# EAGLE design motor-pid-v1 (EAGLE 5.12)
DATABASE: ../../partsdb.txt; PARTNO: MC000048
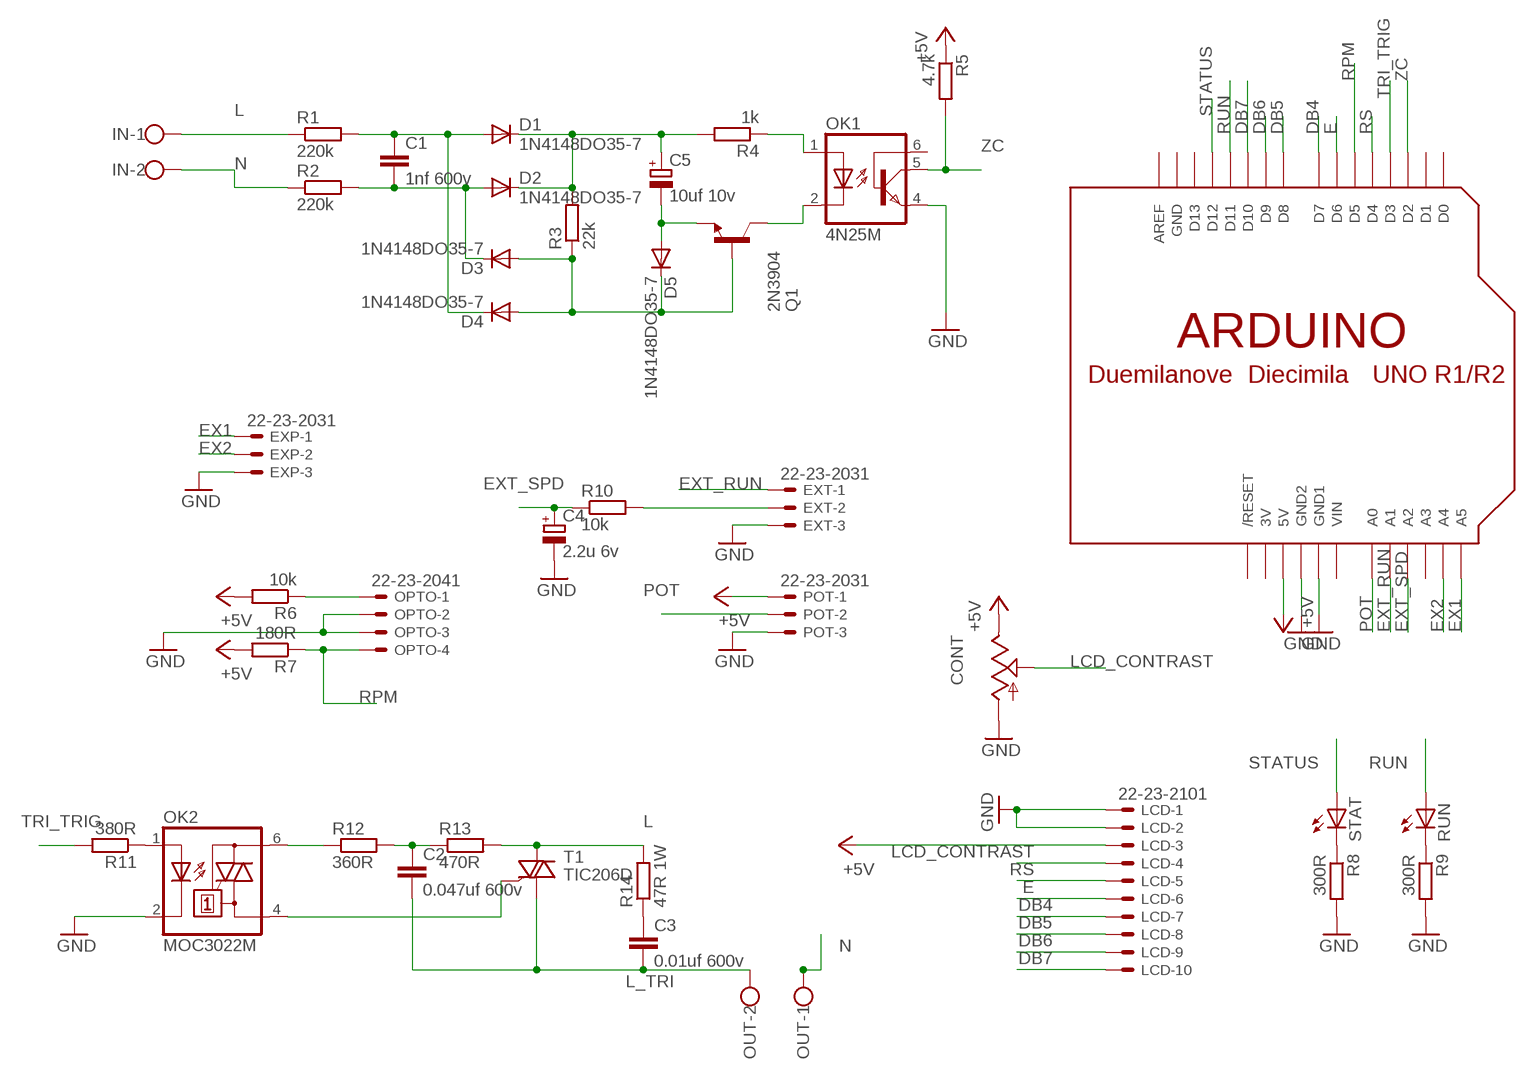
[diagram p0: schematic, sheet 1]

## Parts
C1  1nf 600v  C-EU075-052X106  [C075-052X106]
C2  0.047uf 600v  C-EU075-052X106  [C075-052X106]
C3  0.01uf 600v  C-EU050-050X075  [C050-050X075]
C4  2.2u 6v  CPOL-EUE1.8-4  [E1,8-4]
C5  10uf 10v  CPOL-EUE2.5-5  [E2,5-5]
CONT  TRIM  [6MM]
D1  1N4148DO35-7  DIODE-D-7.5  [D-7.5]
D2  1N4148DO35-7  DIODE-D-7.5  [D-7.5]
D3  1N4148DO35-7  DIODE-D-7.5  [D-7.5]
D4  1N4148DO35-7  DIODE-D-7.5  [D-7.5]
D5  1N4148DO35-7  DIODE-D-7.5  [D-7.5]
EXP  22-23-2031  [22-23-2031]
EXT  22-23-2031  [22-23-2031]
IN  W237-102  [W237-102]
LCD  22-23-2101  [22-23-2101]
OK1  4N25M  [DIL06]
OK2  MOC3022M  [DIL06]
OPTO  22-23-2041  [22-23-2041]
OUT  W237-102  [W237-102]
POT  22-23-2031  [22-23-2031]
Q1  2N3904  [TO92]
R1  220k  R-EU_0204/5  [0204/5]
R2  220k  R-EU_0204/5  [0204/5]
R3  22k  R-EU_0204/5  [0204/5]
R4  1k  R-EU_0204/5  [0204/5]
R5  4.7k  R-EU_0204/5  [0204/5]
R6  10k  R-EU_0204/5  [0204/5]
R7  180R  R-EU_0204/5  [0204/5]
R8  300R  R-EU_0204/5  [0204/5]
R9  300R  R-EU_0204/5  [0204/5]
R10  10k  R-EU_0204/5  [0204/5]
R11  380R  R-EU_0204/5  [0204/5]
R12  360R  R-EU_0207/7  [0207/7]
R13  470R  R-EU_0207/7  [0207/7]
R14  47R 1W  R-EU_0411/12  [0411/12]
RUN  LED5MM  [LED5MM]
STAT  LED5MM  [LED5MM]
T1  TIC206D  [TO220BV]
U$1  ARDUINO-NODIM  [ARDUINO-NODIM]

## Nets
2NB: D3.A D4.A D5.C Q1.2(B) R3.1
2NC: OK1.2(C) Q1.1(C)
2NE: C5.- D5.A Q1.3(E)
+5V: CONT.E LCD.3 POT.1 R5.1 R6.2 R7.2 U$1.5V
DB4: LCD.7 U$1.D7
DB5: LCD.8 U$1.D8
DB6: LCD.9 U$1.D9
DB7: LCD.10 U$1.D10
E: LCD.6 U$1.D6
EX1: EXP.1 U$1.A5
EX2: EXP.2 U$1.A4
EXT_RUN: EXT.1 U$1.A1
EXT_SPD: C4.+ R10.1 U$1.A2
GND: C4.- CONT.A EXP.3 EXT.3 LCD.1 LCD.2 OK1.4(EMI) OK2.2(C) OPTO.2 OPTO.3 POT.3 R8.2 R9.2 U$1.GND1 U$1.GND2
L [power]: IN.1 R1.1 R13.2 R14.2 T1.T2(A2)
L_TRI [power]: C2.2 C3.2 OUT.2 T1.T1(A1)
LCD_CONTRAST: CONT.S LCD.4
N [power]: IN.2 OUT.1 R2.1
N$1: OPTO.1 R6.1
N$2: OK2.6(A2) R12.1
N$3: C1.1 D1.A D4.C R1.2
N$4: C1.2 D2.A D3.C R2.2
N$5: C5.+ D1.C D2.C R3.2 R4.2
N$8: C2.1 R12.2 R13.1
N$9: OK1.1(A) R4.1
N$11: OK2.1(A) R11.1
N$12 [power]: C3.1 R14.1
N$13: R8.1 STAT.K(C)
N$14: R9.1 RUN.K(C)
N$16: EXT.2 R10.2
POT: POT.2 U$1.A0
RPM: OPTO.4 R7.1 U$1.D5
RS: LCD.5 U$1.D4
RUN: RUN.A U$1.D11
STATUS: STAT.A U$1.D12
TRI_GATE: OK2.4(A1) T1.G
TRI_TRIG: R11.2 U$1.D3
ZC: OK1.5(COL) R5.2 U$1.D2
Unconnected: OK1.6(BAS) U$1.A3 U$1.AREF U$1.D0 U$1.D1 U$1.D13 U$1.RESET(/RESET)

## Power pins joined to a net without a drawn wire
3V: U$1.3V
GND: U$1.GND
VIN: U$1.VIN

## Library data of the parts
C1-C3 = matt rcl:C-EU: CAPACITOR, European symbol
C4 = rcl:CPOL-EU: POLARIZED CAPACITOR, European symbol
C5 = matt rcl:CPOL-EU: POLARIZED CAPACITOR, European symbol
CONT = adafruit:TRIM
D1-D5 = diode:DIODE-: DIODE
EXP EXT POT = con-molex:22-23-2031: .100" (2.54mm) Center Header - 3 Pin; MF: MOLEX; MPN: 22-23-2031; OC_FARNELL: 1462950; OC_NEWARK: 30C0862
IN OUT = con-wago-500:W237-102: WAGO SCREW CLAMP; MPN: 237-102; OC_FARNELL: unknown; OC_NEWARK: 70K9898
LCD = con-molex:22-23-2101: .100" (2.54mm) Center Header - 10 Pin; MF: MOLEX; MPN: 22-23-2101; OC_FARNELL: 1756828; OC_NEWARK: 94C0765
OK1 = optocoupler:4N*?M: General Purpose 6-Pin Phototransistor Optocouplers Source: http://www.fairchildsemi.com/ds/4N/4N35-M.pdf; MPN: 4N25-M; OC_FARNELL: 1021349; OC_NEWARK: 98K9084
OK2 = optocoupler:MOC30*M: RANDOM-PHASE OPTOISOLATORS TRIAC DRIVER OUTPUT Source: http://www.fairchildsemi.com MOC3020-M.pdf; MF: FAIRCHILD SEMICONDUCTOR; MPN: MOC3022-M; OC_FARNELL: 1021086; OC_NEWARK: 58K1956
OPTO = con-molex:22-23-2041: .100" (2.54mm) Center Header - 4 Pin; MF: MOLEX; MPN: 22-23-2041; OC_FARNELL: 1462920; OC_NEWARK: 38C0355
Q1 = matt transistor-npn:2N3904: NPN Transistor
R1-R14 = matt rcl:R-EU_: RESISTOR, European symbol
RUN STAT = matt led:LED: LED OSRAM: - CHIPLED LG R971, LG N971, LY N971, LG Q971, LY Q971, LO R971, LY R971 LH N974, LH R974 LS Q976, LO Q976, LY Q976 LO Q996 - Hyper CHIPLED LW Q18S LB Q993, LB Q99A, LB R99A - SideLED LS A670, LO A670, LY A670, LG A670, LP A670 LB A673, LV A673, LT A673, LW A673 LH A674 LY A675 LS A676, LA A676, LO A676, LY A676, LW A676 LS A679, LY A679, LG A679 - Hyper Micro SIDELED® LS Y876, LA Y876, LO Y876, LY Y876 LT Y87S - SmartLED LW L88C, LW L88S LB L89C, LB L89S, LG L890 LS L89K, LO L89K, LY L89K LS L896, LA L896, LO L896, LY L896 - TOPLED LS T670, LO T670, LY T670, LG T670, LP T670 LSG T670, LSP T670, LSY T670, LOP T670, LYG T670 LG T671, LOG T671, LSG T671 LB T673, LV T673, LT T673, LW T673 LH T674 LS T676, LA T676, LO T676, LY T676, LB T676, LH T676, LSB T676, LW T676 LB T67C, LV T67C, LT T67C, LS T67K, LO T67K, LY T67K, LW E67C LS E67B, LA E67B, LO E67B, LY E67B, LB E67C, LV E67C, LT E67C LW T67C LS T679, LY T679, LG T679 LS T770, LO T770, LY T770, LG T770, LP T770 LB T773, LV T773, LT T773, LW T773 LH T774 LS E675, LA E675, LY E675, LS T675 LS T776, LA T776, LO T776, LY T776, LB T776 LHGB T686 LT T68C, LB T68C - Hyper Mini TOPLED® LB M676 - Mini TOPLED Santana® LG M470 LS M47K, LO M47K, LY M47K Source: http://www.osram.convergy.de LUXEON: - LUMILED® LXK2-PW12-R00, LXK2-PW12-S00, LXK2-PW14-U00, LXK2-PW14-V00 LXK2-PM12-R00, LXK2-PM12-S00, LXK2-PM14-U00 LXK2-PE12-Q00, LXK2-PE12-R00, LXK2-PE12-S00, LXK2-PE14-T00, LXK2-PE14-U00 LXK2-PB12-K00, LXK2-PB12-L00, LXK2-PB12-M00, LXK2-PB14-N00, LXK2-PB14-P00, LXK2-PB14-Q00 LXK2-PR12-L00, LXK2-PR12-M00, LXK2-PR14-Q00, LXK2-PR14-R00 LXK2-PD12-Q00, LXK2-PD12-R00, LXK2-PD12-S00 LXK2-PH12-R00, LXK2-PH12-S00 LXK2-PL12-P00, LXK2-PL12-Q00, LXK2-PL12-R00 Source: www.luxeon.com KINGBRIGHT: KA-3528ASYC Source: www.kingbright.com
T1 = triac:TIC206: TRIAC Source: http://www.bourns.com/pdfs/tic206.pdf
U$1 = adafruit:ARDUINO: Arduino Diecimila/Duemilanove Make a shield with ease, this package has all the named pins as well as the two mounting drill holes and an outline of the USB and DC power connector. The outline is on the DIMENSION layer, so if your board house uses it they will cut the outline to match. http://www.ladyada.net/library/pcb/eaglelibrary.html

## Net classes
1 power: width 1.524 mm, clearance 1.016 mm

## Board
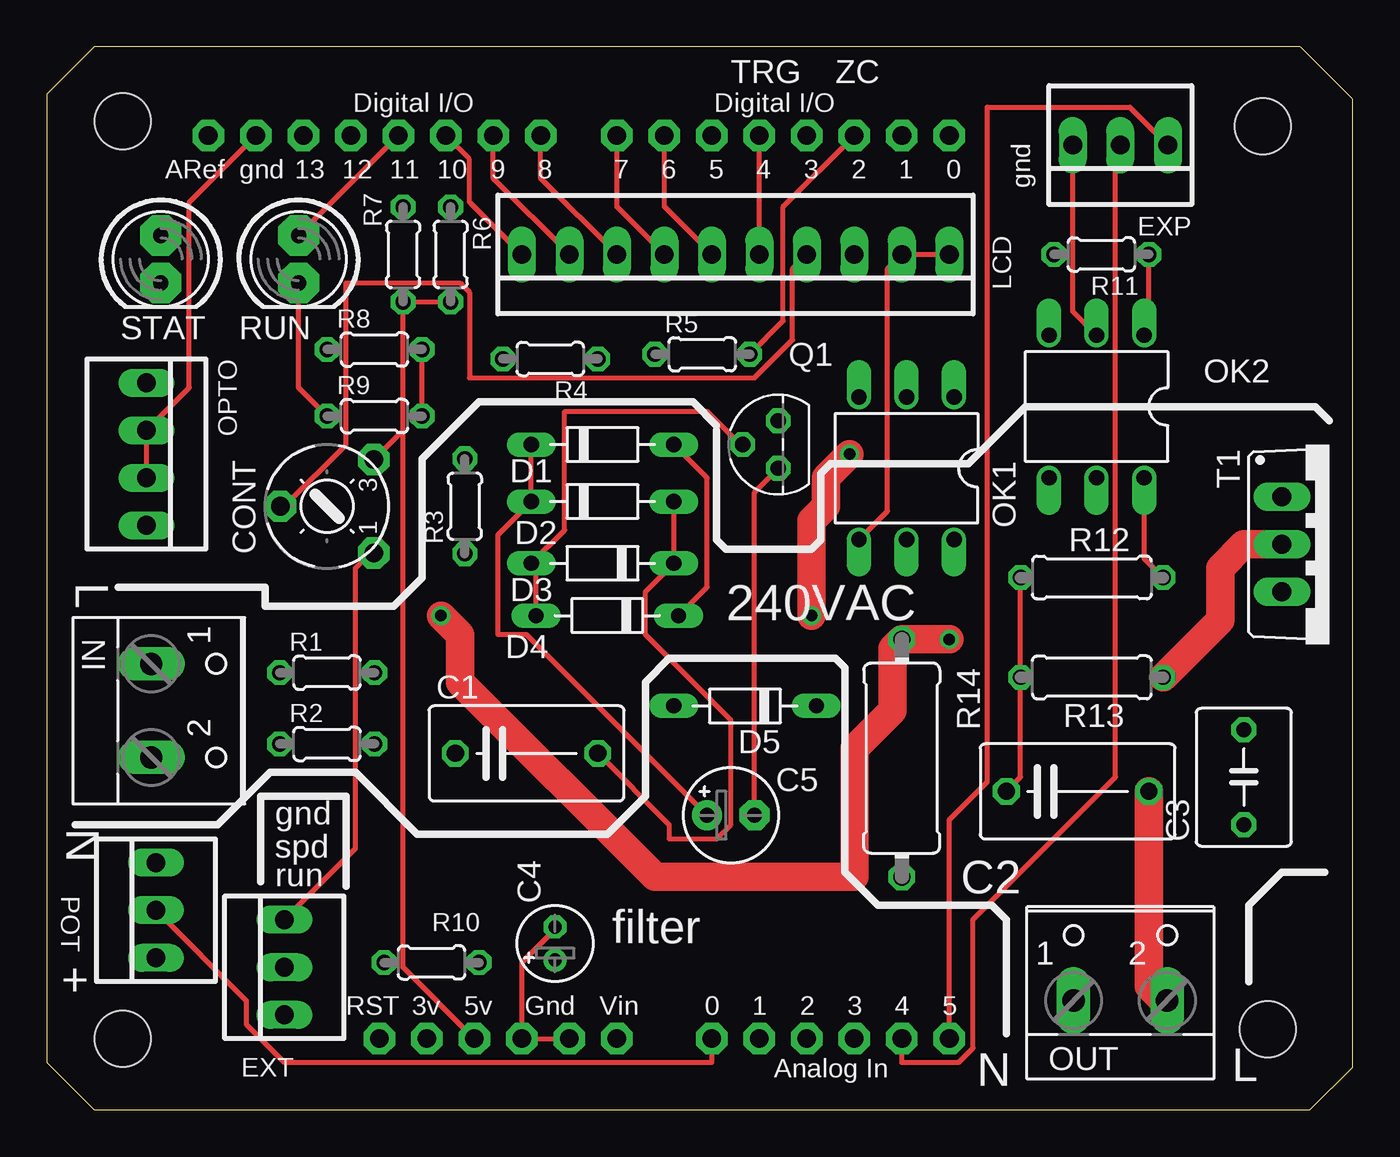
[diagram p1: board, top side]
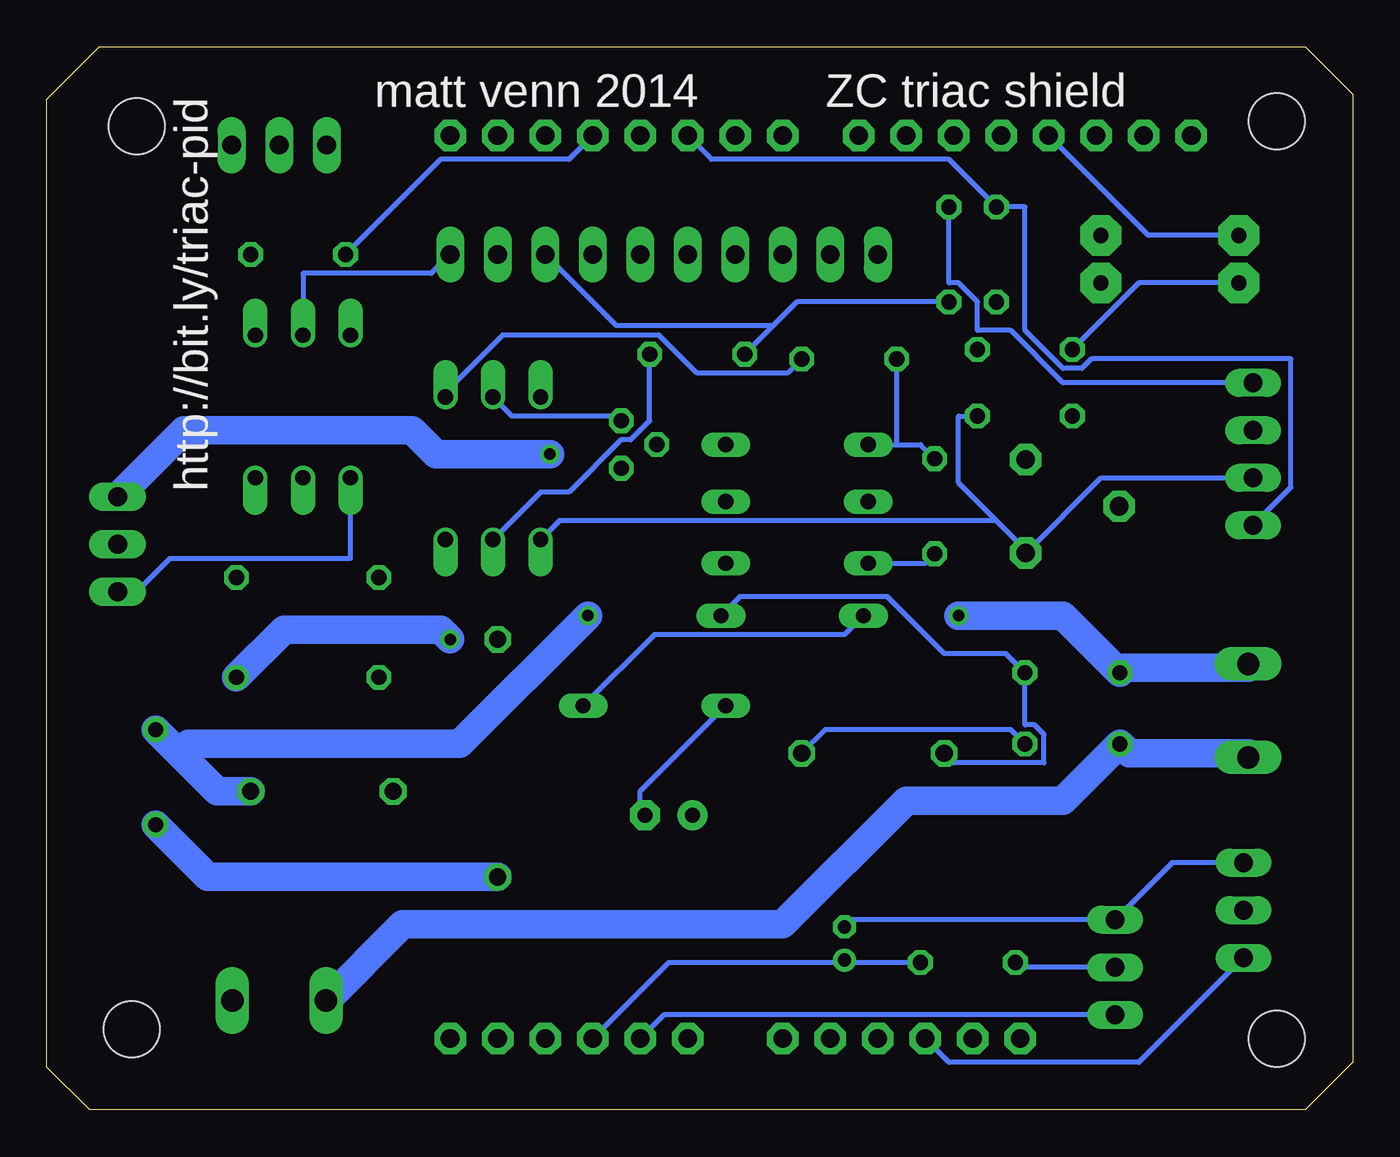
[diagram p2: board, bottom side, seen from below]

Size 69.83 x 56.82 mm. Coordinates in mm from the lower left corner, seen from the top.
Outline: 2.54,56.82 0,54.28 0,2.54 2.54,0 67.54,0 69.83,2.29 69.83,54.03 67.04,56.82 2.54,56.82
Copper layers (1*16): Top 0.035mm / dielectric 1.5mm / Bottom 0.035mm
Design rules "default": minimum track width 10mil, minimum drill 24mil, track to track 8mil, track to pad 8mil, pad to pad 8mil, via to via 8mil, smd to smd 8mil, copper to edge 40mil, drill to drill 8mil, minimum pad ring 10mil, minimum via ring 8mil, stop-mask expansion 4mil, vias tented up to drill 0mil, thermal gap 10mil
Holes 3 mm at 65.02,52.58 4.06,52.83 65.28,4.32 4.06,3.81

### Footprints (pad centres in the part's own frame; a part is rotated, then mirrored left to right if it is on the bottom)
C075-052X106 = drill 0.914 octagon: 1 -3.81,0; 2 3.81,0
C050-050X075 = drill 0.813 octagon: 1 -2.54,0; 2 2.54,0
E1,8-4 = drill 0.711 pad 1.168 round: + -0.889,0 | drill 0.711 pad 1.168 octagon: - 0.889,0
E2,5-5 = drill 0.813 pad 1.6 round: + -1.27,0 | drill 0.813 pad 1.6 octagon: - 1.27,0
6MM = drill 1 pad 1.676 octagon: A -2.5,-2.5; E 2.5,-2.5; S 0,2.5
D-7.5 = drill 0.813 long: A 3.81,0; C -3.81,0
22-23-2031 = drill 1 long: 1 -2.54,0; 2 0,0; 3 2.54,0
W237-102 = drill 1.194 long: 1 -2.5,-1.27; 2 2.5,-1.27
22-23-2101 = drill 1 long: 1 -11.43,0; 2 -8.89,0; 3 -6.35,0; 4 -3.81,0; 5 -1.27,0; 6 1.27,0; 7 3.81,0; 8 6.35,0; 9 8.89,0; 10 11.43,0
DIL06 = drill 0.813 offset: 1 -2.54,-3.81; 2 0,-3.81; 3 2.54,-3.81; 4 2.54,3.81; 5 0,3.81; 6 -2.54,3.81
22-23-2041 = drill 1 long: 1 -3.81,0; 2 -1.27,0; 3 1.27,0; 4 3.81,0
TO92 = drill 0.813 octagon: 1 1.27,0; 2 0,1.905; 3 -1.27,0
0204/5 = drill 0.813 octagon: 1 -2.54,0; 2 2.54,0
0207/7 = drill 0.813 octagon: 1 -3.81,0; 2 3.81,0
0411/12 = drill 0.914 octagon: 1 -6.35,0; 2 6.35,0
LED5MM = drill 0.813 pad 2.184 octagon: A -1.27,0; K 1.27,0
TO220BV = drill 1.016 long: G 2.54,-2.54; T1 -2.54,-2.54; T2 0,-2.54
ARDUINO-NODIM = drill 1 pad 1.676 octagon: 3V -11.43,-25.4; 5V -8.89,-25.4; A0 3.81,-25.4; A1 6.35,-25.4; A2 8.89,-25.4; A3 11.43,-25.4; A4 13.97,-25.4; A5 16.51,-25.4; AREF -23.114,22.86; D0 16.51,22.86; D1 13.97,22.86; D2 11.43,22.86; D3 8.89,22.86; D4 6.35,22.86; D5 3.81,22.86; D6 1.27,22.86; D7 -1.27,22.86; D8 -5.334,22.86; D9 -7.874,22.86; D10 -10.414,22.86; D11 -12.954,22.86; D12 -15.494,22.86; D13 -18.034,22.86; GND -20.574,22.86; GND1 -3.81,-25.4; GND2 -6.35,-25.4; RESET -13.97,-25.4; VIN -1.27,-25.4

### Placement (x,y rotation side)
C1  25.65,19.05 0 top
C2  55.12,17.02 0 top
C3  64.01,17.78 90 top
C4  27.18,8.89 90 top
C5  36.58,15.75 0 top
CONT  14.99,32.26 90 top
D1  29.72,35.56 0 top
D2  29.72,32.51 0 top
D3  29.72,29.21 180 top
D4  29.97,26.42 180 top
D5  37.34,21.59 180 top
EXP  57.4,51.56 180 top
EXT  12.7,7.62 90 top
IN  6.86,21.34 270 top
LCD  36.83,45.72 180 top
OK1  45.97,34.29 180 top
OK2  56.13,37.59 180 top
OPTO  5.33,35.05 270 top
OUT  57.4,7.11 0 top
POT  5.84,10.67 90 top
Q1  39.12,35.56 90 top
R1  14.99,23.37 0 top
R2  14.99,19.56 0 top
R3  22.35,32.26 90 top
R4  26.92,40.13 180 top
R5  35.05,40.39 0 top
R6  21.59,45.72 270 top
R7  19.05,45.72 270 top
R8  17.53,40.64 0 top
R9  17.53,37.08 0 top
R10  20.57,7.87 180 top
R11  56.39,45.72 180 top
R12  55.88,28.45 180 top
R13  55.88,23.11 0 top
R14  45.72,18.8 90 top
RUN  13.46,45.47 270 top
STAT  6.1,45.47 270 top
T1  68.58,30.23 270 top
U$1  31.75,29.21 0 top

### Tracks (layer width: path | path; a pad name or v marks a point on that pad's centre or on a via)
2NB
  Top 0.254: D4.A 26.16,28.96 D3.A 27.69,30.99 27.69,37.34 35.31,37.34 37.08,35.56 Q1.2
  Bottom 0.254: D5.C 37.34,25.4 27.18,25.4 D4.A | R3.1 22.86,29.21 D3.A
2NC
  Bottom 0.254: Q1.1 39.37,37.08 44.96,37.08 OK1.2
2NE
  Top 0.254: Q1.3 37.85,33.02 C5.-
  Bottom 0.254: D5.A 38.1,17.02 38.1,15.75 C5.-
+5V
  Top 0.254: R6.2 R7.2 19.05,36.32 | 19.05,36.32 CONT.E | U$1.5V 19.05,7.62 19.05,36.32
  Bottom 0.254: POT.1 11.43,2.54 21.59,2.54 U$1.5V | 30.99,41.91 29.72,43.18 R6.2 | 30.99,41.91 R5.1 | LCD.3 39.37,41.91 30.99,41.91
DB4
  Top 0.254: LCD.7 30.48,48.26 U$1.D7
DB5
  Top 0.254: LCD.8 26.42,49.78 U$1.D8
DB6
  Top 0.254: LCD.9 23.88,49.78 U$1.D9
DB7
  Top 0.254: LCD.10 22.61,48.51 22.61,50.8 U$1.D10
E
  Top 0.254: LCD.6 33.02,48.26 U$1.D6
EX1
  Top 0.254: EXP.1 57.91,53.59 50.29,53.59 50.29,17.53 48.26,15.49 U$1.A5
EX2
  Top 0.254: EXP.2 57.15,51.31 57.15,17.78 49.53,10.16 49.53,3.3 48.77,2.54 45.72,2.54 U$1.A4
EXT_RUN
  Bottom 0.254: EXT.1 36.83,5.08 U$1.A1
EXT_SPD
  Bottom 0.254: R10.1 27.18,7.87 | U$1.A2 36.58,7.87 27.18,7.87 | 27.18,7.87 C4.+
GND
  Top 0.254: OK2.2 54.86,42.67 EXP.3 | OK1.4 44.96,32 44.96,44.96 LCD.2 LCD.1 | C4.- 27.18,9.65 25.4,7.87 U$1.GND2 U$1.GND1 | R9.2 R8.2 | OPTO.3 OPTO.2 7.62,38.61 7.62,48.51 U$1.GND | EXT.3 16.51,13.97 16.51,28.96 17.27,29.72 CONT.A
  Bottom 0.254: OK2.2 56.13,44.7 49.28,44.7 LCD.1 | POT.3 9.65,13.21 EXT.3 26.92,10.16 27.18,9.91 C4.- | 19.05,31.5 21.08,33.53 21.08,37.08 R9.2 | 19.05,31.5 17.53,29.97 CONT.A 13.46,33.78 OPTO.3 | OK1.4 42.42,31.5 19.05,31.5
L  (via drill 0.61)
  Top 1.524: R13.2 62.74,26.16 62.74,28.96 64.01,30.23 T1.T2 | v48.26,25.15 R14.2 45.21,24.64 45.21,21.34 43.18,19.3 43.18,12.45 32.51,12.45 22.1,22.86 22.1,25.4 v21.08,26.42
  Bottom 1.524: IN.1 5.59,23.62 12.19,23.62 R1.1 15.49,26.42 v21.08,26.42 | v48.26,25.15 48.77,25.65 57.15,25.65 R13.2
L_TRI  (via drill 0.61)
  Top 1.524: v42.93,35.05 41.66,33.78 41.66,32.26 40.89,31.5 v40.89,26.42 | C2.2 58.93,6.6 59.69,5.84 OUT.2
  Bottom 1.524: 62.74,19.05 60.71,17.02 C2.2 | 62.74,19.05 C3.2 | T1.T1 62.48,36.32 50.29,36.32 49.02,35.05 v42.93,35.05 | v40.89,26.42 47.75,19.56 62.23,19.56 62.74,19.05
LCD_CONTRAST
  Top 0.254: LCD.4 39.88,44.96 39.88,41.15 37.85,39.12 22.61,39.12 22.61,43.69 22.1,44.2 16,44.2 16,35.56 12.7,32.26 CONT.S
N
  Bottom 1.524: IN.2 5.59,19.05 11.94,19.05 R2.1 15.49,16.51 23.88,16.51 30.48,9.91 50.8,9.91 54.86,5.84 OUT.1
N$1
  Bottom 0.254: R6.1 21.59,44.2 21.08,44.2 20.07,43.18 20.07,41.66 18.29,41.66 15.49,38.86 OPTO.1
N$2
  Top 0.254: R12.1 58.67,29.46 OK2.6
N$3
  Top 0.254: D4.C 35.31,27.94 35.31,33.78 D1.A
  Bottom 0.254: C1.1 21.34,18.54 16.51,18.54 16.51,20.07 17.02,20.57 17.53,20.57 R1.2 18.54,24.38 21.84,24.38 24.89,27.43 32.77,27.43 D4.C
N$4
  Top 0.254: D2.A D3.C 32,27.69 32,25.4 36.58,20.83 36.58,15.24 35.81,14.48 33.27,14.48 33.27,15.24 C1.2
  Bottom 0.254: R2.2 18.29,20.32 28.19,20.32 C1.2
N$5
  Top 0.254: D1.C D2.C 24.13,30.73 24.13,25.4 25.65,25.4 C5.+
  Bottom 0.254: R3.2 23.11,35.56 24.38,35.56 | D1.C 24.38,35.56 | 24.38,35.56 R4.2
N$8
  Top 0.254: R12.2 R13.1 52.07,17.78 C2.1
N$9
  Bottom 0.254: R4.1 30.23,39.37 35.05,39.37 37.08,41.4 45.47,41.4 48.51,38.35 OK1.1
N$11
  Top 0.254: OK2.1 58.93,41.66 R11.1
N$12
  Bottom 1.524: C3.1 61.21,12.45 R14.1
N$13
  Bottom 0.254: R8.1 11.43,44.2 STAT.K
N$14
  Top 0.254: R9.1 13.46,38.61 RUN.K
N$16
  Bottom 0.254: R10.2 17.78,7.62 EXT.2
POT
  Top 0.254: POT.2 10.67,5.84 10.67,4.57 12.7,2.54 35.56,2.54 U$1.A0
RPM
  Bottom 0.254: U$1.D5 34.29,50.8 21.59,50.8 R7.1 17.53,48.26 17.53,41.66 15.49,39.62 14.48,39.62 13.97,40.13 3.3,40.13 3.3,33.27 OPTO.4
RS
  Top 0.254: LCD.5 U$1.D4
RUN
  Top 0.254: RUN.A U$1.D11
STATUS
  Bottom 0.254: U$1.D12 10.92,46.74 STAT.A
TRI_GATE
  Bottom 0.254: OK2.4 53.59,29.46 63.25,29.46 65.02,27.69 T1.G
TRI_TRIG
  Bottom 0.254: R11.2 48.77,50.8 41.91,50.8 U$1.D3
ZC
  Top 0.254: R5.2 39.37,42.16 39.37,48.26 U$1.D2
  Bottom 0.254: OK1.5 43.43,33.02 41.91,33.02 39.12,35.81 38.61,35.81 37.59,36.83 R5.2

### Text on the board
tNames: TRG | ZC | gnd | L | 240VAC | gnd | N | spd | run | filter | + | L | N
bNames: http://bit.ly/triac-pid | ZC triac shield | matt venn 2014